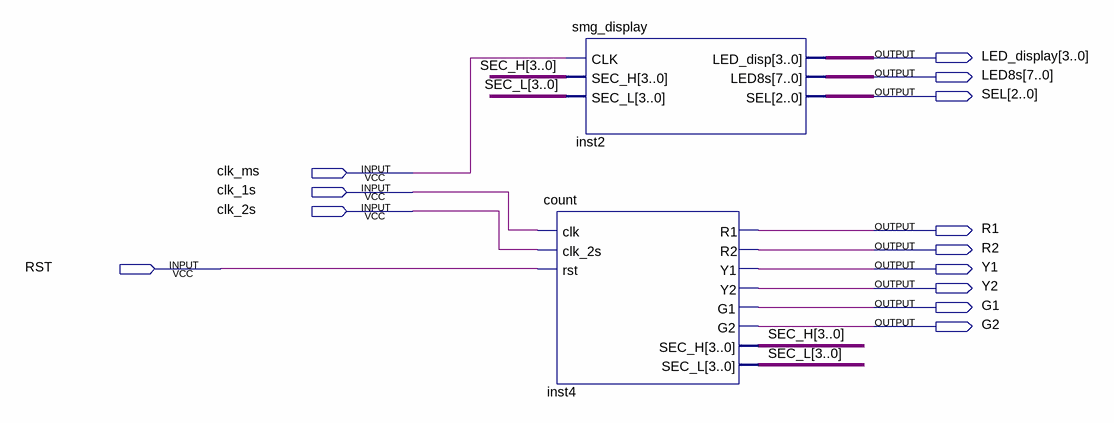
[diagram p0: schematic sheet]
// Quartus schematic traffic.bdf as structural Verilog: 2 symbols, 13 pins
module traffic (
  input  clk_ms,
  input  clk_1s,
  input  clk_2s,
  input  RST,
  output [3:0] LED_display,
  output [7:0] LED8s,
  output [2:0] SEL,
  output R1,
  output R2,
  output Y1,
  output Y2,
  output G1,
  output G2
);

  wire [3:0] SEC_H, SEC_L;

  smg_display inst2 (.CLK(clk_ms), .SEC_H(SEC_H), .SEC_L(SEC_L), .LED_disp(LED_display), .LED8s(LED8s), .SEL(SEL));
  count inst4 (
    .clk(clk_1s), .clk_2s(clk_2s), .rst(RST), .R1(R1), .R2(R2), .Y1(Y1), .Y2(Y2), .G1(G1), .G2(G2),
    .SEC_H(SEC_H), .SEC_L(SEC_L));
endmodule
